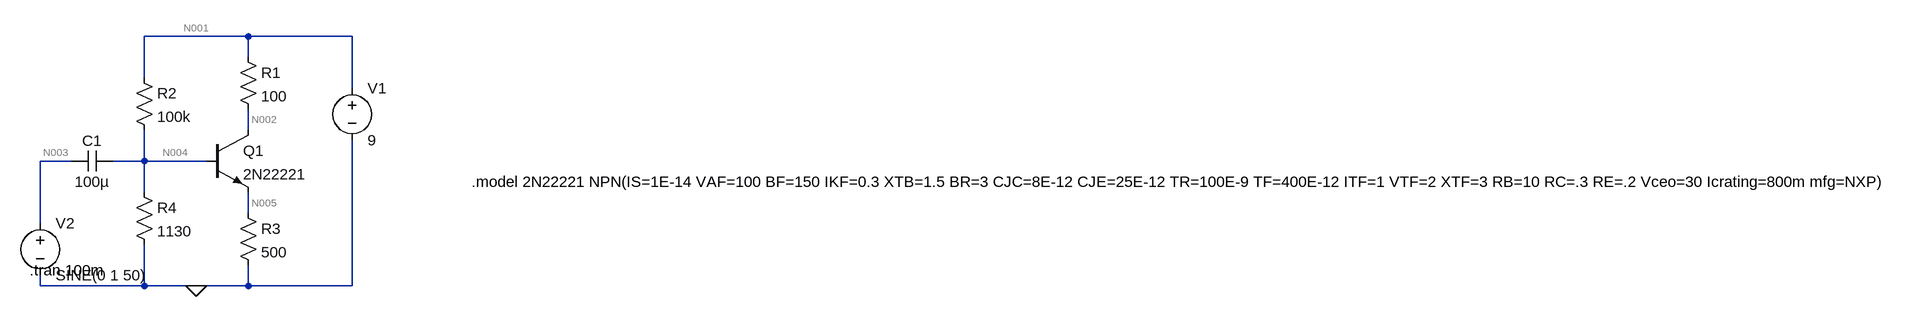
[diagram p0: schematic project3.asc]
project3.asc, the LTspice schematic file:
Version 4.1
SHEET 1 2896 680
WIRE 240 0 80 0
WIRE 400 0 240 0
WIRE 240 32 240 0
WIRE 80 64 80 0
WIRE 400 80 400 0
WIRE 240 144 240 112
WIRE -32 192 -80 192
WIRE 80 192 80 144
WIRE 80 192 32 192
WIRE 176 192 80 192
WIRE 80 240 80 192
WIRE 240 272 240 240
WIRE -80 288 -80 192
WIRE -80 384 -80 368
WIRE 80 384 80 320
WIRE 80 384 -80 384
WIRE 160 384 80 384
WIRE 240 384 240 352
WIRE 240 384 160 384
WIRE 400 384 400 160
WIRE 400 384 240 384
FLAG 160 384 0
SYMBOL npn 176 144 R0
SYMATTR InstName Q1
SYMATTR Value 2N22221
SYMBOL res 224 16 R0
SYMATTR InstName R1
SYMATTR Value 100
SYMBOL res 64 48 R0
SYMATTR InstName R2
SYMATTR Value 100k
SYMBOL voltage 400 64 R0
WINDOW 123 0 0 Left 0
WINDOW 39 0 0 Left 0
SYMATTR InstName V1
SYMATTR Value 9
SYMBOL res 224 256 R0
SYMATTR InstName R3
SYMATTR Value 500
SYMBOL res 64 224 R0
SYMATTR InstName R4
SYMATTR Value 1130
SYMBOL cap 32 176 R90
WINDOW 0 0 32 VBottom 2
WINDOW 3 32 32 VTop 2
SYMATTR InstName C1
SYMATTR Value 100µ
SYMBOL voltage -80 272 R0
WINDOW 123 0 0 Left 0
WINDOW 39 0 0 Left 0
SYMATTR InstName V2
SYMATTR Value SINE(0 1 50)
TEXT -96 360 Left 2 !.tran 100m
TEXT 584 224 Left 2 !.model 2N22221 NPN(IS=1E-14 VAF=100 BF=150 IKF=0.3 XTB=1.5 BR=3 CJC=8E-12 CJE=25E-12 TR=100E-9 TF=400E-12 ITF=1 VTF=2 XTF=3 RB=10 RC=.3 RE=.2 Vceo=30 Icrating=800m mfg=NXP)

The netlist it stands for:
* project3.asc
Q1 N002 N004 N005 0 2N22221
R1 N001 N002 100
R2 N001 N004 100k
V1 N001 0 9
R3 N005 0 500
R4 N004 0 1130
C1 N004 N003 100µ
V2 N003 0 SINE(0 1 50)
.model NPN NPN
.model PNP PNP
.lib standard.bjt
.tran 100m
.model 2N22221 NPN(IS=1E-14 VAF=100 BF=150 IKF=0.3 XTB=1.5 BR=3 CJC=8E-12 CJE=25E-12 TR=100E-9 TF=400E-12 ITF=1 VTF=2 XTF=3 RB=10 RC=.3 RE=.2 Vceo=30 Icrating=800m mfg=NXP)
.backanno
.end

* Results of the author's LTspice run, read from the files saved beside the schematic
* Operating Point, zero values left out:
*   V(n004) = 100.6 mV
*   V(n001) = 9 V
*   V(n002) = 9 V
*   Ic(Q1) = 9.438 pA
*   Ib(Q1) = -8.799 pA
*   I(R2) = 88.99 µA
*   I(R4) = 88.99 µA
*   I(V1) = -88.99 µA
*   I(R1) = 9.432 pA
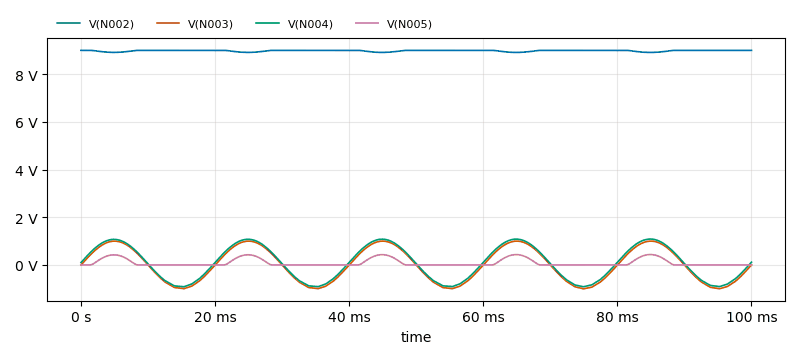
[diagram p1: Transient Analysis of project3.asc, plotted from the saved traces]
* Transient Analysis, 1 run:
*   V(N002): min 8.913 V, max 9 V, average 8.982 V, rms 8.982 V, last 9 V
*   V(N003): min -999.8 mV, max 999.9 mV, average 3.312 mV, rms 704.3 mV, last 0 V
*   V(N004): min -914.2 mV, max 1.086 V, average 84.61 mV, rms 708.4 mV, last 116.7 mV
*   V(N005): min -4.376 µV, max 435.8 mV, average 91.69 mV, rms 176 mV, last 4.149 µV